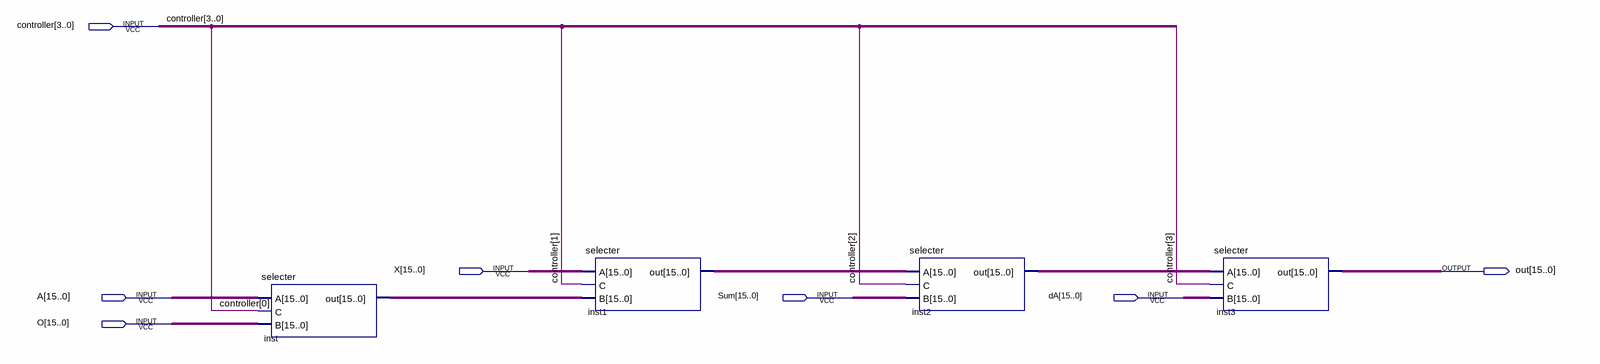
[diagram p0: schematic sheet]
// Quartus schematic MUX.bdf as structural Verilog: 4 symbols, 7 pins
module MUX (
  input  [3:0] controller,
  input  [15:0] X,
  input  [15:0] A,
  input  [15:0] Sum,
  input  [15:0] dA,
  input  [15:0] O,
  output [15:0] out
);

  wire [15:0] inst1_out, inst2_out, inst_out;

  selecter inst (.A(A), .C(controller[0]), .B(O), .out(inst_out));
  selecter inst1 (.A(X), .C(controller[1]), .B(inst_out), .out(inst1_out));
  selecter inst2 (.A(inst1_out), .C(controller[2]), .B(Sum), .out(inst2_out));
  selecter inst3 (.A(inst2_out), .C(controller[3]), .B(dA), .out(out));
endmodule
